# Altium project IS25LP128_Breakout_PCB.PrjPcb
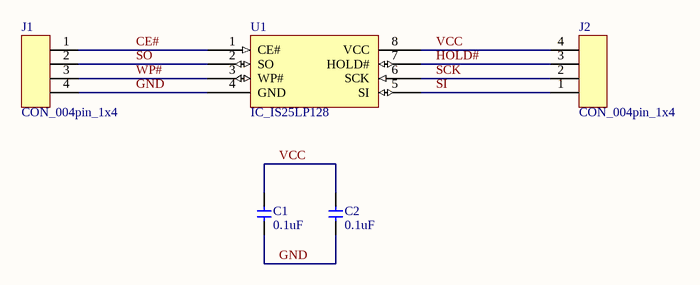
[diagram p0: IS25LP128_Breakout_PCB.SchDoc]
1 sheet, 5 parts. Net scope: global (net labels, ports and power ports of the same name join across sheets).
Board file: IS25LP128_Breakout_PCB.PcbDoc

## Sheet IS25LP128_Breakout_PCB.SchDoc
size A; SheetNumber: 1; SheetTotal: 1

### Parts
C1  0.1uF  [0603]
C2  0.1uF  [0603]
J1  CON_004pin_1x4  [CON-004-100-400X100/1X4-POST]
J2  CON_004pin_1x4  [CON-004-100-400X100/1X4-POST]
U1  IC_IS25LP128  [GW-08-1.27-5.2X8.0]

### Nets
CE#: J1.1 U1.1(CE#)
GND: C1.2 C2.2 J1.4 U1.4(GND)
HOLD#: J2.3 U1.7(HOLD#)
SCK: J2.2 U1.6(SCK)
SI: J2.1 U1.5(SI)
SO: J1.2 U1.2(SO)
VCC: C1.1 C2.1 J2.4 U1.8(VCC)
WP#: J1.3 U1.3(WP#)

### Library data of the parts
C1 C2 = DISCRETE_C: Capacitor generic
J1 J2 = CON_004pin_1x4: Con 4 pins 1x4